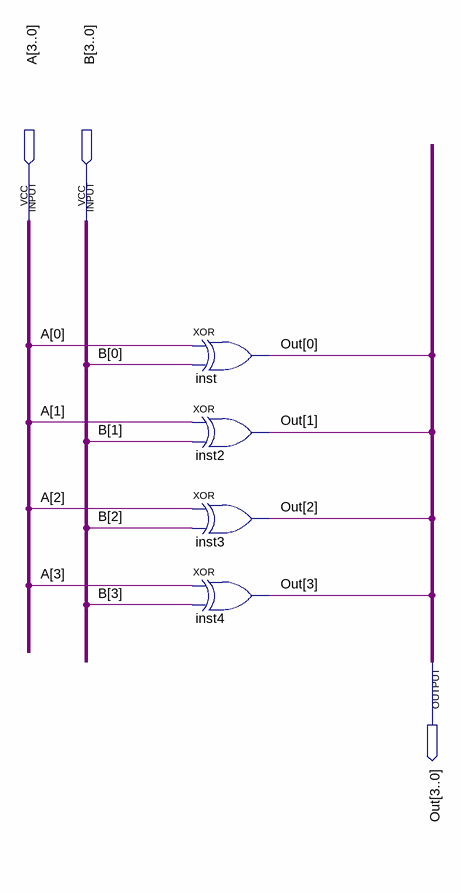
[diagram p0: schematic sheet]
// Quartus schematic Xor_completo.bdf as structural Verilog: 4 symbols, 3 pins
module Xor_completo (
  input  [3:0] A,
  input  [3:0] B,
  output [3:0] Out
);

  xor inst (Out[0], A[0], B[0]);
  xor inst2 (Out[1], A[1], B[1]);
  xor inst3 (Out[2], A[2], B[2]);
  xor inst4 (Out[3], A[3], B[3]);
endmodule
